# Altium schematic sheet ElectricalDiagram.SchDoc
size A
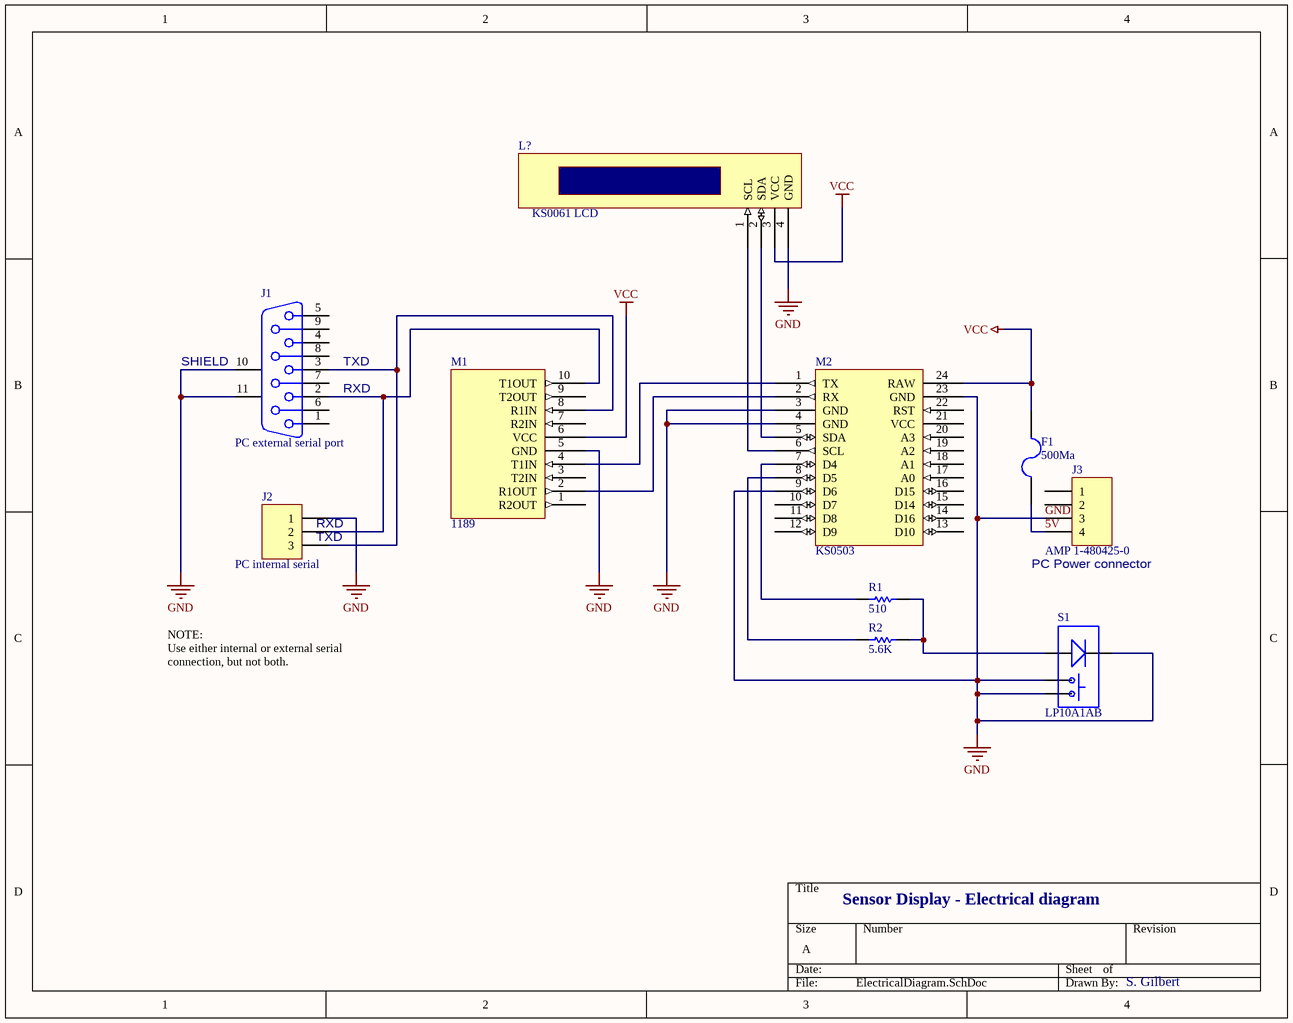
[diagram p0: ElectricalDiagram.SchDoc]

## Parts
F1  500Ma  [PIN-W2/E2.8]
J1  PC external serial port  [DSUB1.385-2H9]
J2  PC internal serial  [HDR1X3]
J3  AMP 1-480425-0  [HDR1X4]
L?  KS0061 LCD
M1  1189
M2  KS0503
R1  510  [AXIAL-0.3]
R2  5.6K  [AXIAL-0.3]
S1  LP10A1AB

## Nets
GND: J1.10(MH1) J1.11(MH2) J2.1 J3.3 L?.4(GND) M1.5(GND) M2.3(GND) M2.4(GND) M2.9(D6) M2.23(GND) S1.2(K) S1.3 S1.4
VCC: F1.2 L?.3(VCC) M1.6(VCC) M2.24(RAW)
5V: F1.1 J3.4
NetJ1_2: J1.2 J2.2 M1.10(T1OUT)
NetJ1_3: J1.3 J2.3 M1.8(R1IN)
NetL?_1: L?.1(SCL) M2.6(SCL)
NetL?_2: L?.2(SDA) M2.5(SDA)
NetM1_2: M1.2(R1OUT) M2.2(RX)
NetM1_4: M1.4(T1IN) M2.1(TX)
NetM2_7: M2.7(D4) R1.1
NetM2_8: M2.8(D5) R2.1
NetR1_2: R1.2 R2.2 S1.1(A)

Not connected (* = marked no-connect by the designer): J1 1 4 5 6 7 8 9; J3 1 2; M1 1(R2OUT) 3(T2IN) 7(R2IN) 9(T2OUT); M2 10(D7) 11(D8) 12(D9) 13(D10) 14(D16) 15(D14) 16(D15) 17(A0) 18(A1) 19(A2) 20(A3) 21(VCC) 22(RST)

## Notes on the sheet
- (near J1) SHIELD
- (near J1) TXD
- (near J1) RXD
- (near J2) RXD
- (near J2) TXD
- (near J3) PC Power connector
- NOTE:
  Use either internal or external serial connection, but not both.
- Sensor Display - Electrical diagram
- S. Gilbert

## Library data of the parts
F1 = Fuse 2: Fuse; Published: 8-Jun-2000; LatestRevisionDate: 17-Jul-2002; LatestRevisionNote: Re-released for DXP Platform.; PackageReference: PIN-W2/E2.8; Publisher: Altium Limited; PackageDescription: Thru-Hole; 2 Leads
J1 = D Connector 9: Receptacle Assembly, 9 Position, Right Angle; PackageDocument: O; Positions: 9; Published: 15-Jun-2001; LatestRevisionDate: 17-Jul-2002; LatestRevisionNote: Re-released for DXP Platform.; DatasheetDocument: 1-Sep-1999; PackageReference: 788750; Publisher: Altium Limited; Orientation: Right Angle; Gender: Receptacle
J2 = Header 3: Header, 3-Pin; LatestRevisionDate: 17-Jul-2002; LatestRevisionNote: Re-released for DXP Platform.; Publisher: Altium Limited
J3 = Header 4: Header, 4-Pin; LatestRevisionDate: 17-Jul-2002; LatestRevisionNote: Re-released for DXP Platform.; Publisher: Altium Limited
L? = KS0061
M1 = 11189: MAX3232 Tranceiver
R1 = Res1: Resistor; Published: 8-Jun-2000; LatestRevisionDate: 17-Jul-2002; LatestRevisionNote: Re-released for DXP Platform.; PackageReference: AXIAL-0.3; Publisher: Altium Limited; PackageDescription: Axial Device, Thru-Hole; 2 Leads; 0.3 in Pin Spacing; Value: 510
R2 = Res1: Resistor; Value: 1K; Published: 8-Jun-2000; LatestRevisionDate: 17-Jul-2002; LatestRevisionNote: Re-released for DXP Platform.; PackageReference: AXIAL-0.3; Publisher: Altium Limited; PackageDescription: Axial Device, Thru-Hole; 2 Leads; 0.3 in Pin Spacing
S1 = Push_Button_led